# Altium schematic sheet MTCH9010_Evaluation_Kit_Revision_History.SchDoc
size A3; SheetTitle: Revision History; CompanyName: Microchip Technology Inc.; Organization: Microchip Technology; Address1: 2355 West Chandler Blvd.; Address2: Chandler, AZ  85224; Address4: USA; SheetNumber: 4; SheetTotal: 4; Time: Time
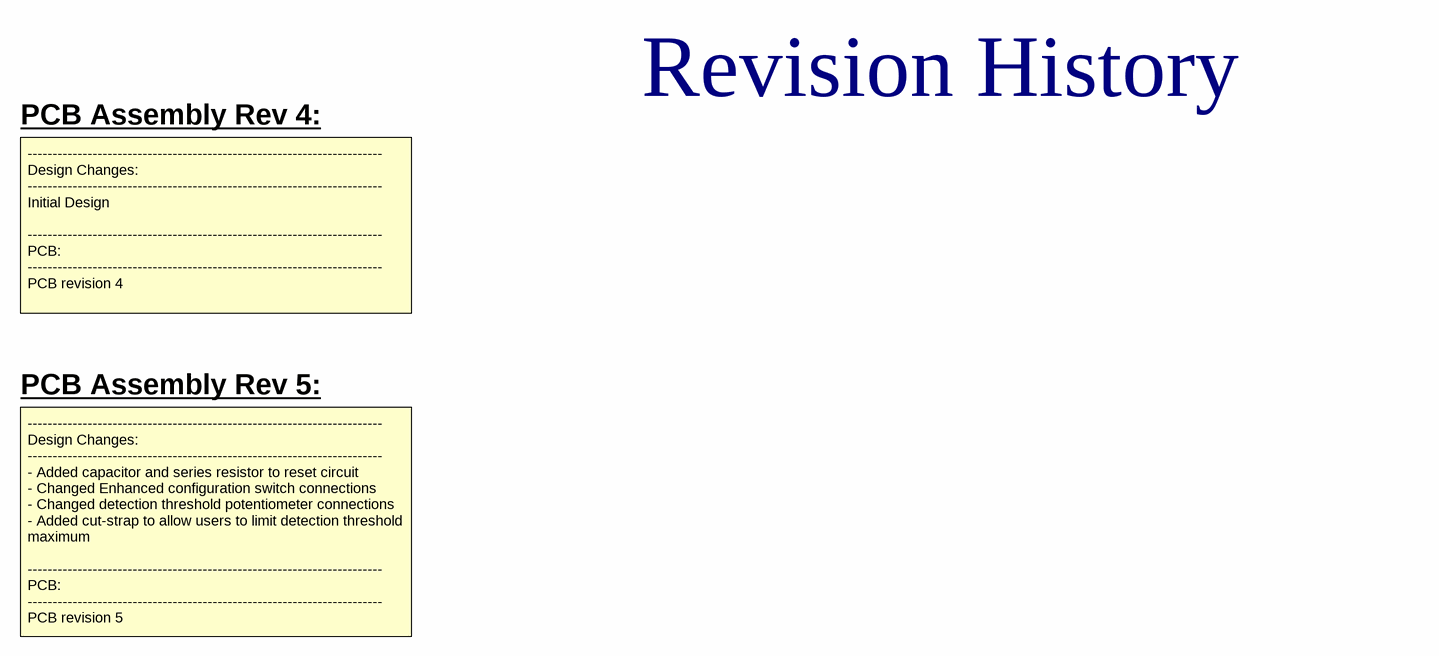
[diagram p0: MTCH9010_Evaluation_Kit_Revision_History.SchDoc]

## Notes on the sheet
- Revision History
- PCB Assembly Rev 4:
- -----------------------------------------------------------------------
  Design Changes:
  -----------------------------------------------------------------------
  Initial Design
  -----------------------------------------------------------------------
  PCB:
  -----------------------------------------------------------------------
  PCB revision 4
- PCB Assembly Rev 5:
- -----------------------------------------------------------------------
  Design Changes:
  -----------------------------------------------------------------------
  - Added capacitor and series resistor to reset circuit
  - Changed Enhanced configuration switch connections
  - Changed detection threshold potentiometer connections
  - Added cut-strap to allow users to limit detection threshold maximum
  -----------------------------------------------------------------------
  PCB:
  -----------------------------------------------------------------------
  PCB revision 5
- Project Owner:
- PCB Layout Contact:
- PartNumber:
- Project Title
- Variant:
- Sheet Title
- Size
- A3
- SCH #:
- PCB #:
- Rev:
- Date:
- Sheet
- Designed with
- Altium.com <http://go.altium.com/MicrochipLandingPage_Evaluation.html>
- File: